# Altium project Battery Monitor.PrjPcb
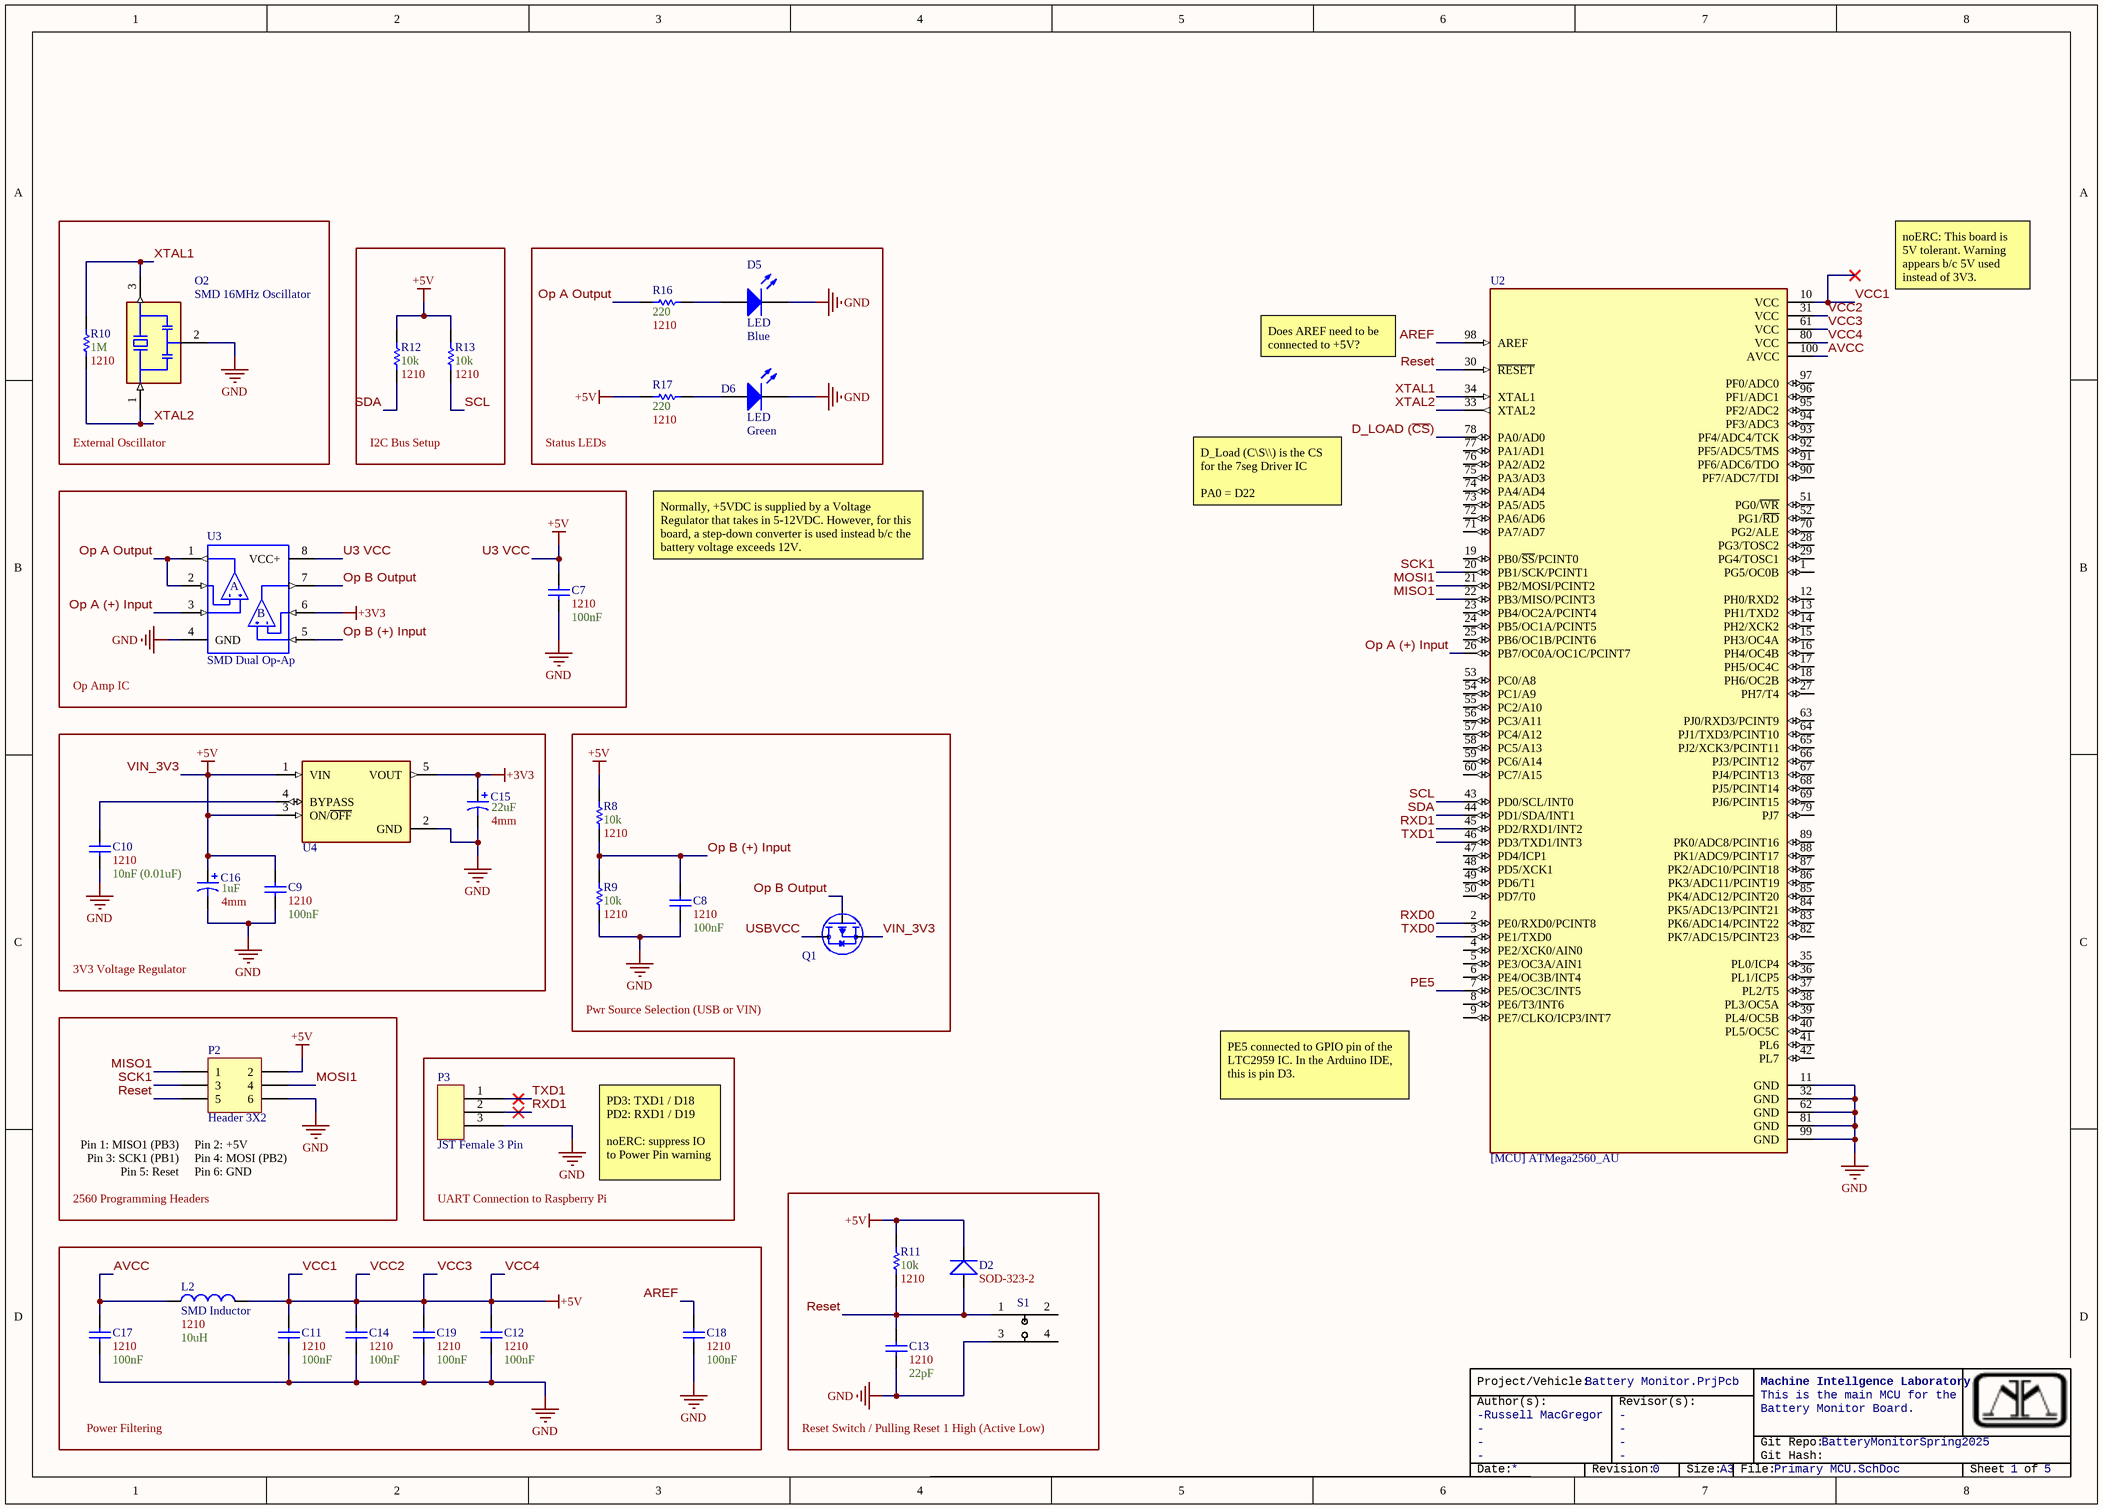
[diagram p0: Primary MCU.SchDoc]
Author1: Russell MacGregor; Revision: 0; SheetTotal: 4
3 sheets, 44 parts. Net scope: global (net labels, ports and power ports of the same name join across sheets).
Board file: main.PcbDoc
Sheets:
  Primary MCU.SchDoc
  DC Step-Down Converter.SchDoc
  Seven-Seg Displays.SchDoc

## Sheet Primary MCU.SchDoc
size A3; ENG_APP_DATE: --/--/--; DSN_APP_DATE: --/--/--; CHK_APP_DATE: --/--/--; Sheet_Number: 1; Author1: Russell MacGregor; VersionControl_Repository: BatteryMonitorSpring2025; Date: 03/09/2025; Organization: Machine Intellgence Laboratory; Des1: This is the main MCU for the; Des2: Battery Monitor Board.; Revision: 0; SheetNumber: 1; SheetTotal: 5; Time: 12:13 AM

### Parts
C7  Size Package: 1210  Capacitance: 100nF  [SMD Capacitor [1210]]  (hidden comment: SMD Cap - Nonpolarized)
C8  Size Package: 1210  Capacitance: 100nF  [SMD Capacitor [1210]]  (hidden comment: SMD Cap - Nonpolarized)
C9  Size Package: 1210  Capacitance: 100nF  [SMD Capacitor [1210]]  (hidden comment: SMD Cap - Nonpolarized)
C10  Size Package: 1210  Capacitance: 10nF (0.01uF)  [SMD Capacitor [1210]]  (hidden comment: SMD Cap - Nonpolarized)
C11  Size Package: 1210  Capacitance: 100nF  [SMD Capacitor [1210]]  (hidden comment: SMD Cap - Nonpolarized)
C12  Size Package: 1210  Capacitance: 100nF  [SMD Capacitor [1210]]  (hidden comment: SMD Cap - Nonpolarized)
C13  Size Package: 1210  Capacitance: 22pF  [SMD Capacitor [1210]]  (hidden comment: SMD Cap - Nonpolarized)
C14  Size Package: 1210  Capacitance: 100nF  [SMD Capacitor [1210]]  (hidden comment: SMD Cap - Nonpolarized)
C15  Capacitance: 22uF  Diameter: 4mm  [SMD Cap - Polarized, 4mm]  (hidden comment: SMD Cap - Polarized)
C16  Capacitance: 1uF  Diameter: 4mm  [SMD Cap - Polarized, 4mm]  (hidden comment: SMD Cap - Polarized)
C17  Size Package: 1210  Capacitance: 100nF  [SMD Capacitor [1210]]  (hidden comment: SMD Cap - Nonpolarized)
C18  Size Package: 1210  Capacitance: 100nF  [SMD Capacitor [1210]]  (hidden comment: SMD Cap - Nonpolarized)
C19  Size Package: 1210  Capacitance: 100nF  [SMD Capacitor [1210]]  (hidden comment: SMD Cap - Nonpolarized)
D2  Size Package: SOD-323-2  [SMD Diode [SOD-323-2]]  (hidden comment: SMD Diode)
D5  LED  Color: Blue  [LED [3mm, Blue]]
D6  LED  Color: Green  [Small Green LED]
L2  SMD Inductor  Size Package: 1210  Inductance: 10uH  [SMD Inductor [0603]]
O2  SMD 16MHz Oscillator  [SMD 16MHz Oscillator [1]]
P2  Header 3X2  [HDR2X3]
P3  JST Female 3 Pin  [Jst Female 3pin]
Q1  SMD Mosfet (Part #: PMV48XP)  [SMD Mosfet (Part #: PMV48XP)]  (value not drawn)
R8  Resistance: 10k  Size Package: 1210  [SMD Resistor [1210]]  (hidden comment: SMD Resistor)
R9  Resistance: 10k  Size Package: 1210  [SMD Resistor [1210]]  (hidden comment: SMD Resistor)
R10  Resistance: 1M  Size Package: 1210  [SMD Resistor [1210]]  (hidden comment: SMD Resistor)
R11  Resistance: 10k  Size Package: 1210  [SMD Resistor [1210]]  (hidden comment: SMD Resistor)
R12  Resistance: 10k  Size Package: 1210  [SMD Resistor [1210]]  (hidden comment: SMD Resistor)
R13  Resistance: 10k  Size Package: 1210  [SMD Resistor [1210]]  (hidden comment: SMD Resistor)
R16  Resistance: 220  Size Package: 1210  [SMD Resistor [1210]]  (hidden comment: SMD Resistor)
R17  Resistance: 220  Size Package: 1210  [SMD Resistor [1210]]  (hidden comment: SMD Resistor)
S1  Thru-Hole Pushbutton  [Thru-Hole Pushbutton]  (value not drawn)
U2  [MCU] ATMega2560_AU  [SMD ATMega2560_AU]
U3  SMD Dual Op-Ap  [SMD Dual Op-Ap (LMV358IDGKR)]
U4  SMD 3V3 Regulator  [SMD 3V3 Regulator]  (value not drawn)

### Blocks framed on the sheet
External Oscillator: O2 R10
I2C Bus Setup: R12 R13
Status LEDs: D5 D6 R16 R17
Op Amp IC: C7 U3
3V3 Voltage Regulator: C9 C10 C15 C16 U4
Pwr Source Selection (USB or VIN): C8 Q1 R8 R9
UART Connection to Raspberry Pi: P3
Reset Switch / Pulling Reset 1 High (Active Low): C13 D2 R11 S1
Power Filtering: C11 C12 C14 C17-C19 L2

### Nets
+3V3: C15.1 U3.6(2IN-) U4.5(VOUT)
+5V: C7.2 C9.2 C11.2 C12.2 C14.2 C16.1 C19.2 D2.C L2.2 P2.2 Q1.2(S) R8.2 R11.2 R12.2 R13.2 R17.2 U2.10(VCC) U2.31(VCC) U2.61(VCC) U2.80(VCC) U3.8(VCC+) U4.1(VIN) U4.3(ON/~{OFF})  [also labelled U3 VCC, VCC1, VCC2, VCC3, VCC4, VIN_3V3]  [project net LM2576_FEEDBACK]
GND: C7.1 C8.1 C9.1 C10.1 C11.1 C12.1 C13.1 C14.1 C15.2 C16.2 C17.1 C18.1 C19.1 D5.2(K) D6.2(K) O2.2(GND) P2.6 P3.3 R9.1 S1.3 U2.11(GND) U2.32(GND) U2.62(GND) U2.81(GND) U2.99(GND) U3.4(GND) U4.2(GND)
AREF: C18.2 U2.98(AREF)
AVCC: C17.2 L2.1 U2.100(AVCC)
D_LOAD (~{CS}): U2.78(PA0/AD0)
MISO1: P2.1 U2.22(PB3/MISO/PCINT3)
MOSI1: P2.4 U2.21(PB2/MOSI/PCINT2)
Op A (+) Input: U2.26(PB7/OC0A/OC1C/PCINT7) U3.3(1IN+)
Op A Output: R16.2 U3.1(1OUT) U3.2(1IN-)
Op B (+) Input: C8.2 R8.1 R9.2 U3.5(2IN+)
Op B Output: Q1.1(G) U3.7(2OUT)
PE5: U2.7(PE5/OC3C/INT5)
Reset: C13.2 D2.A P2.5 R11.1 S1.1 U2.30(~{RESET})
RXD0: U2.2(PE0/RXD0/PCINT8)
RXD1: P3.2 U2.45(PD2/RXD1/INT2)
SCK1: P2.3 U2.20(PB1/SCK/PCINT1)
SCL: R13.1 U2.43(PD0/SCL/INT0)
SDA: R12.1 U2.44(PD1/SDA/INT1)
TXD0: U2.3(PE1/TXD0)
TXD1: P3.1 U2.46(PD3/TXD1/INT3)
USBVCC: Q1.3(D)
XTAL1: O2.3(OUT) R10.2 U2.34(XTAL1)
XTAL2: O2.1(IN) R10.1 U2.33(XTAL2)
NetC10_2: C10.2 U4.4(BYPASS)
NetD5_1: D5.1(A) R16.1
NetD6_1: D6.1(A) R17.1

Not connected (* = marked no-connect by the designer): S1 2 4; U2 1(PG5/OC0B) 4(PE2/XCK0/AIN0) 5(PE3/OC3A/AIN1) 6(PE4/OC3B/INT4) 8(PE6/T3/INT6) 9(PE7/CLKO/ICP3/INT7) 12(PH0/RXD2) 13(PH1/TXD2) 14(PH2/XCK2) 15(PH3/OC4A) 16(PH4/OC4B) 17(PH5/OC4C) 18(PH6/OC2B) 19(PB0/~{SS}/PCINT0) 23(PB4/OC2A/PCINT4) 24(PB5/OC1A/PCINT5) 25(PB6/OC1B/PCINT6) 27(PH7/T4) 28(PG3/TOSC2) 29(PG4/TOSC1) 35(PL0/ICP4) 36(PL1/ICP5) 37(PL2/T5) 38(PL3/OC5A) 39(PL4/OC5B) 40(PL5/OC5C) 41(PL6) 42(PL7) 47(PD4/ICP1) 48(PD5/XCK1) 49(PD6/T1) 50(PD7/T0) 51(PG0/~{WR}) 52(PG1/~{RD}) 53(PC0/A8) 54(PC1/A9) 55(PC2/A10) 56(PC3/A11) 57(PC4/A12) 58(PC5/A13) 59(PC6/A14) 60(PC7/A15) 63(PJ0/RXD3/PCINT9) 64(PJ1/TXD3/PCINT10) 65(PJ2/XCK3/PCINT11) 66(PJ3/PCINT12) 67(PJ4/PCINT13) 68(PJ5/PCINT14) 69(PJ6/PCINT15) 70(PG2/ALE) 71(PA7/AD7) 72(PA6/AD6) 73(PA5/AD5) 74(PA4/AD4) 75(PA3/AD3) 76(PA2/AD2) 77(PA1/AD1) 79(PJ7) 82(PK7/ADC15/PCINT23) 83(PK6/ADC14/PCINT22) 84(PK5/ADC13/PCINT21) 85(PK4/ADC12/PCINT20) 86(PK3/ADC11/PCINT19) 87(PK2/ADC10/PCINT18) 88(PK1/ADC9/PCINT17) 89(PK0/ADC8/PCINT16) 90(PF7/ADC7/TDI) 91(PF6/ADC6/TDO) 92(PF5/ADC5/TMS) 93(PF4/ADC4/TCK) 94(PF3/ADC3) 95(PF2/ADC2) 96(PF1/ADC1) 97(PF0/ADC0)

### Notes on the sheet
- noERC: This board is 5V tolerant. Warning appears b/c 5V used instead of 3V3.
- Does AREF need to be connected to +5V?
- D_Load (C\S\\) is the CS for the 7seg Driver IC
  PA0 = D22
- Normally, +5VDC is supplied by a Voltage Regulator that takes in 5-12VDC. However, for this board, a step-down converter is used instead b/c the battery voltage exceeds 12V.
- PE5 connected to GPIO pin of the LTC2959 IC. In the Arduino IDE, this is pin D3.
- (near P2) Pin 1: MISO1 (PB3)
- Pin 3: SCK1 (PB1)
- Pin 5: Reset
- (near P2) Pin 2: +5V
- Pin 4: MOSI (PB2)
- Pin 6: GND
- PD3: TXD1 / D18
  PD2: RXD1 / D19
  noERC: suppress IO to Power Pin warning
- 2560 Programming Headers
- Project/Vehicle:
- Author(s):
- -
- Revisor(s):
- Git Repo:
- Git Hash:
- Date:
- Revision:
- Size:
- A3
- File:
- Sheet
- of
- (in symbol SMD Dual Op-Ap) A; B

### Library data of the parts
C15 C16 = SMD Cap - Polarized: Diameter: 4mm; JLC Part #: *
  C15: Mouser Part #: 667-EEE-FN1C220R
  C16: Mouser Part #: 80-EXV105M050A9BAA
D2 = SMD Diode: Part #: CD1206-S01575; JLC Part #: C75465
D5 = LED [3mm]: 3mm LED
D6 = Small LED: 3mm LED
O2 = SMD 16MHz Oscillator [1]: Part #: CSTNE16M0V530000R0 / JLC Part #: C341521; JLC Part #: C341521
P2 = Header 3X2: Header, 3-Pin, Dual row; LatestRevisionDate: 17-Jul-2002; LatestRevisionNote: Re-released for DXP Platform.; Publisher: Altium Limited
Q1 = SMD Mosfet (Part #: PMV48XP): JLC Part #: C2959854
R8 R9 R11 R13 R16 R17 = SMD Resistor: JLC Part #: C728401 / (for 1M Ohm Res)
  R8 R9 R11 R13: Mouser Part #: 71-CRCW121010K0JNAIF
  R16 R17: Mouser Part #: 71-CRCW1210220RJNEAH
S1 = Thru-Hole Pushbutton: Tactile 4pin SPST Pushbutton / (what I expect is a regular pushbutton)
U2 = [MCU] ATMega2560_AU: JLC Part #: C22460
U3 = SMD Dual Op-Ap: Part #: LMV358IDGKR; JLC Part #: C105242
U4 = SMD 3V3 Regulator: Part #: LP2985-33DBVR / JLC Part #: C95414; JLC Part #: C95414; Mouser Part #: 595-LP2985-33DBVR
C7-C14 C17-C19 = SMD Cap - Nonpolarized: JLC Part #: *
  C7-C9 C11 C12 C14 C17-C19: Mouser Part #: 581-12107C104KAT2A
  C10: Mouser Part #: 810-CGA6P1C0G3B103G2
  C13: Mouser Part #: 77-VJ1210A220JXGAT5Z
L2 = SMD Inductor: JLC Part #: *; Mouser Part #: *
R10 R12 = SMD Resistor
  R10: Mouser Part #: 71-CRCW12101M00FKEAH
  R12: Mouser Part #: 71-CRCW121010K0JNAIF

## Sheet DC Step-Down Converter.SchDoc
size A4; Organization: Machine Intelligence Laboratory; SheetNumber: 4; SheetTotal: 5; Des1: This steps down the ~22V; Des2: from the battery to 5V for use; Des3: with PCB electronics.; Author1: Russell MacGregor; VersionControl_Repository: BatteryMonitorSpring2025
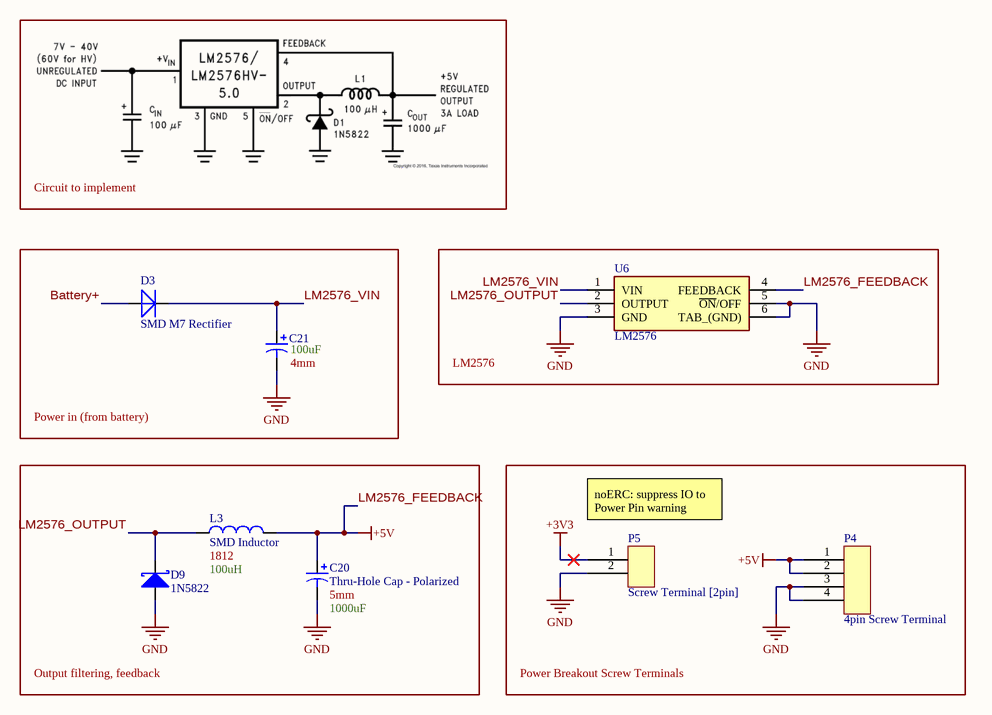
[diagram p1: DC Step-Down Converter.SchDoc]

### Parts
C20  Thru-Hole Cap - Polarized  Pin Spacing: 5mm  Capacitance: 1000uF  [Thru-Hole Polarized Cap [3.5mm]]
C21  Capacitance: 100uF  Diameter: 4mm  [SMD Cap - Polarized, 4mm]  (hidden comment: SMD Cap - Polarized)
D3  SMD M7 Rectifier  [SMD M7 Rectifier]
D9  1N5822  [1N5822 Schottky Diode]
L3  SMD Inductor  Size Package: 1812  Inductance: 100uH  [SMD Inductor [1812]]
P4  4pin Screw Terminal  [Screw Terminal [4pin]]
P5  Screw Terminal [2pin]  [Screw Terminal [2pin]]
U6  LM2576  [LM2576 Step Down Converter]

### Blocks framed on the sheet
Power in (from battery): C21 D3
LM2576: U6
Output filtering, feedback: C20 D9 L3
Power Breakout Screw Terminals: P4 P5

### Nets
+3V3: P5.1
GND: C20.2 C21.2 D9.2(A) P4.3 P4.4 P5.2 U6.3(GND) U6.5(~{ON}/OFF) U6.6(TAB_(GND))
LM2576_FEEDBACK: C20.1 L3.2 P4.1 P4.2 U6.4(FEEDBACK)  [also labelled +5V]
Battery+: D3.A
LM2576_OUTPUT: D9.1(K) L3.1 U6.2(OUTPUT)
LM2576_VIN: C21.1 D3.C U6.1(VIN)

### Notes on the sheet
- Circuit to implement
- (near P5) noERC: suppress IO to Power Pin warning
- Project/Vehicle:
- Author(s):
- -
- Revisor(s):
- Git Repo:
- Git Hash:
- Date:
- Revision:
- Size:
- A4
- File:
- Sheet
- of

### Library data of the parts
C21 = SMD Cap - Polarized: Diameter: 4mm; JLC Part #: *; Mouser Part #: 667-EEE-FT0J101AR
D3 = SMD M7 Rectifier: JLC Part #: C95872
D9 = 1N5822 Schottky Diode: Mouser Part #: 511-1N5822
P4 = Screw Terminal [4pin]
U6 = LM2576 Step Down Converter
C20 = Thru-Hole Cap - Polarized: JLC Part #: *; Mouser Part #: 594-MAL214236102E3
L3 = SMD Inductor: JLC Part #: *; Mouser Part #: 70-ISC1812ER101J

## Sheet Seven-Seg Displays.SchDoc
size A4; Organization: Machine Intellgence Laboratory; Des1: This board uses a 4-digit; Des2: seven-segment display to show; Des3: battery voltage & current draw.; SheetNumber: 5; SheetTotal: 5; Author1: Russell MacGregor; VersionControl_Repository: BatteryMonitorSpring2025
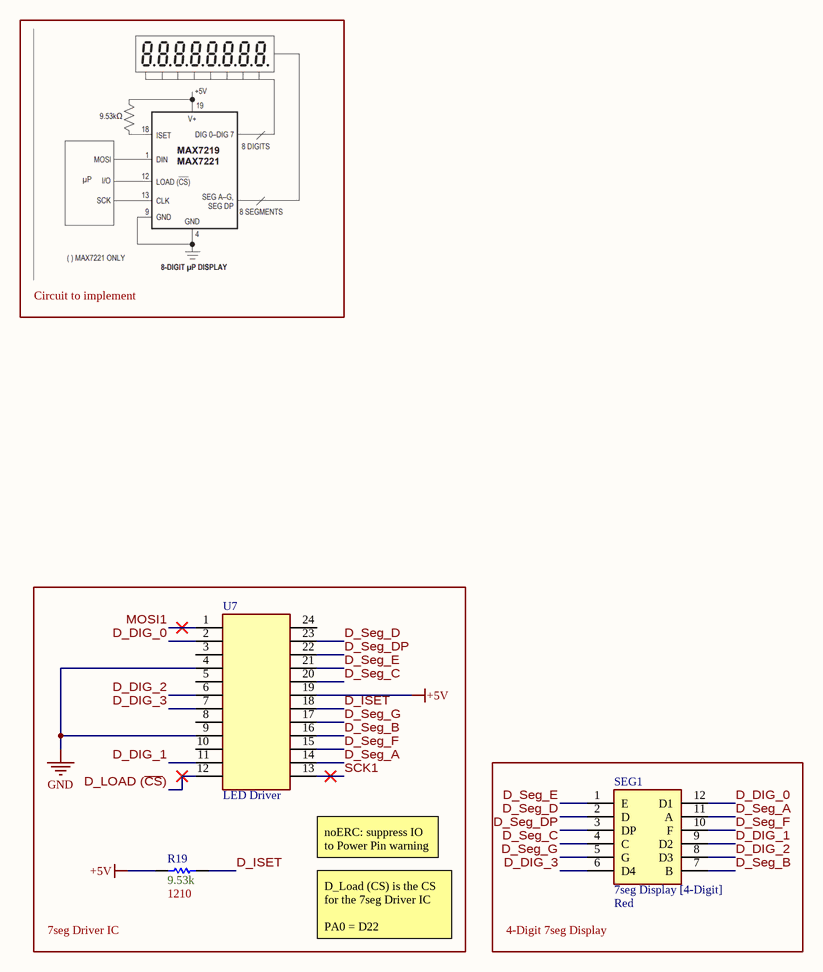
[diagram p2: Seven-Seg Displays.SchDoc]

### Parts
R19  Resistance: 9.53k  Size Package: 1210  [SMD Resistor [1210]]  (hidden comment: SMD Resistor)
SEG1  7seg Display [4-Digit]  Color: Red  [7seg Display [4 Digit]]
U7  LED Driver  [DIP IC [24pin, IC]]

### Blocks framed on the sheet
7seg Driver IC: R19 U7
4-Digit 7seg Display: SEG1

### Nets
+5V: R19.1 U7.19(V+)  [project net LM2576_FEEDBACK]
GND: U7.4(GND) U7.9(GND)
D_DIG_0: SEG1.12(D1) U7.2(DIG0)
D_DIG_1: SEG1.9(D2) U7.11(DIG1)
D_DIG_2: SEG1.8(D3) U7.6(DIG2)
D_DIG_3: SEG1.6(D4) U7.7(DIG3)
D_ISET: R19.2 U7.18(ISET)
D_LOAD (~{CS}): U7.12(LOAD_(~{CS}))
D_Seg_A: SEG1.11(A) U7.14(SEGA)
D_Seg_B: SEG1.7(B) U7.16(SEGB)
D_Seg_C: SEG1.4(C) U7.20(SEGC)
D_Seg_D: SEG1.2(D) U7.23(SEGD)
D_Seg_DP: SEG1.3(DP) U7.22(SEGDP)
D_Seg_E: SEG1.1(E) U7.21(SEGE)
D_Seg_F: SEG1.10(F) U7.15(SEGF)
D_Seg_G: SEG1.5(G) U7.17(SEGG)
MOSI1: U7.1(DIN)
SCK1: U7.13(CLK)

Not connected (* = marked no-connect by the designer): U7 3(DIG4) 5(DIG6) 8(DIG7) 10(DIG5) 24(DOUT)

### Notes on the sheet
- Circuit to implement
- (near U7) noERC: suppress IO to Power Pin warning
- D_Load (CS) is the CS for the 7seg Driver IC
  PA0 = D22
- Project/Vehicle:
- Author(s):
- -
- Revisor(s):
- Git Repo:
- Git Hash:
- Date:
- Revision:
- Size:
- A4
- File:
- Sheet
- of

### Library data of the parts
R19 = SMD Resistor: JLC Part #: C728401 / (for 1M Ohm Res); JLC Part #: C728401; Mouser Part #: ERJ-14NF9531U
U7 = DIP IC [24pin]: Mouser Part #: 700-MAX7219ENG
SEG1 = 7seg Display [4-Digit]: Mouser Part #: 474-COM-11405

## Nets that join several sheets
+3V3: Primary MCU (C15.1 U3.6 U4.5), DC Step-Down Converter (P5.1)
GND: Primary MCU (27 pins), DC Step-Down Converter (9 pins), Seven-Seg Displays (U7.4 U7.9)
LM2576_FEEDBACK: Primary MCU (23 pins), DC Step-Down Converter (5 pins), Seven-Seg Displays (R19.1 U7.19)
D_LOAD (~{CS}): Primary MCU (U2.78), Seven-Seg Displays (U7.12)
MOSI1: Primary MCU (P2.4 U2.21), Seven-Seg Displays (U7.1)
SCK1: Primary MCU (P2.3 U2.20), Seven-Seg Displays (U7.13)